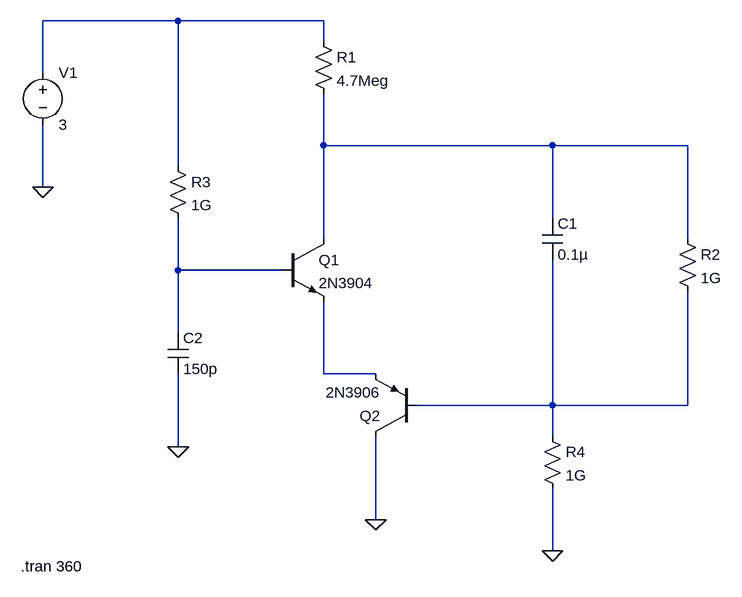
[diagram p0: schematic 3na_oscillator_v000.asc]
3na_oscillator_v000.asc, the LTspice schematic file:
Version 4
SHEET 1 880 744
WIRE -240 -112 -448 -112
WIRE -16 -112 -240 -112
WIRE -16 -80 -16 -112
WIRE -448 -32 -448 -112
WIRE -16 80 -16 0
WIRE 336 80 -16 80
WIRE 544 80 336 80
WIRE -240 112 -240 -112
WIRE -448 144 -448 48
WIRE 336 192 336 80
WIRE -16 224 -16 80
WIRE 544 224 544 80
WIRE -240 272 -240 192
WIRE -80 272 -240 272
WIRE -240 368 -240 272
WIRE -16 432 -16 320
WIRE 64 432 -16 432
WIRE 336 480 336 256
WIRE 336 480 128 480
WIRE 544 480 544 304
WIRE 544 480 336 480
WIRE 336 528 336 480
WIRE -240 544 -240 432
WIRE 64 656 64 528
WIRE 336 704 336 608
FLAG 64 656 0
FLAG -448 144 0
FLAG -240 544 0
FLAG 336 704 0
SYMBOL res -32 -96 R0
SYMATTR InstName R1
SYMATTR Value 4.7Meg
SYMBOL res 528 208 R0
SYMATTR InstName R2
SYMATTR Value 1G
SYMBOL res -256 96 R0
SYMATTR InstName R3
SYMATTR Value 1G
SYMBOL cap -256 368 R0
SYMATTR InstName C2
SYMATTR Value 150p
SYMATTR SpiceLine V=50 Irms=31.2m Rser=0.363412 Lser=0 mfg="KEMET" pn="C0603C151K5RAC" type="X7R"
SYMBOL npn -80 224 R0
SYMATTR InstName Q1
SYMATTR Value 2N3904
SYMBOL pnp 128 528 R180
SYMATTR InstName Q2
SYMATTR Value 2N3906
SYMBOL voltage -448 -48 R0
WINDOW 123 0 0 Left 0
WINDOW 39 0 0 Left 0
SYMATTR InstName V1
SYMATTR Value 3
SYMBOL res 320 512 R0
SYMATTR InstName R4
SYMATTR Value 1G
SYMBOL cap 320 192 R0
SYMATTR InstName C1
SYMATTR Value 0.1µ
SYMATTR SpiceLine V=25 Irms=0 Rser=0 Lser=0 mfg="Murata" pn="GCM155R71E104KE02" type="X7R"
TEXT -482 728 Left 2 !.tran 360

The netlist it stands for:
* 3na_oscillator_v000.asc
R1 N001 N002 4.7Meg
R2 N002 N005 1G
R3 N001 N003 1G
C2 N003 0 150p V=50 Irms=31.2m Rser=0.363412 Lser=0 mfg="KEMET" pn="C0603C151K5RAC" type="X7R"
Q1 N002 N003 N004 0 2N3904
Q2 0 N005 N004 0 2N3906
V1 N001 0 3
R4 N005 0 1G
C1 N002 N005 0.1µ V=25 Irms=0 Rser=0 Lser=0 mfg="Murata" pn="GCM155R71E104KE02" type="X7R"
.model NPN NPN
.model PNP PNP
.lib standard.bjt
.tran 360
.backanno
.end